# Altium project 260115710xxxx-HW-2.0.PrjPcb
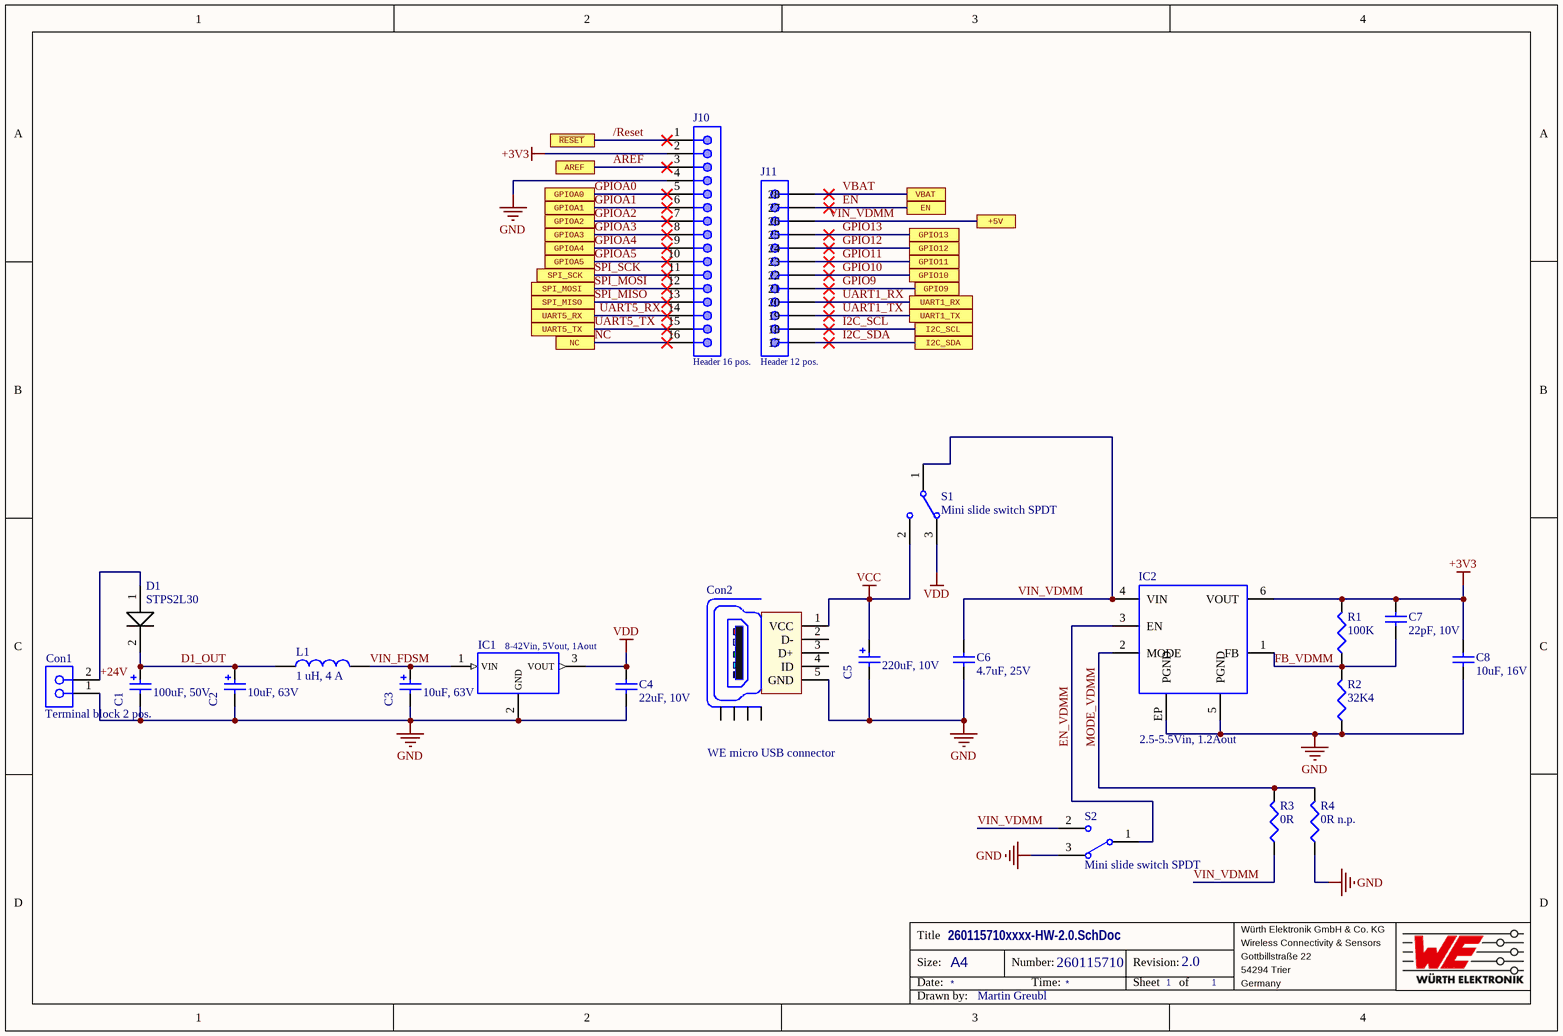
[diagram p0: 260115710xxxx-HW-2.0.SchDoc]
1 sheet, 22 parts. Net scope: flat (ports and power ports of the same name join across sheets).
Board file: 260115710xxxx-HW-2.0.PcbDoc

## Sheet 260115710xxxx-HW-2.0.SchDoc: FeatherWing
size A4; DrawnBy: Martin Greubl; DocumentNumber: 260115710; Revision: 2.0; SheetNumber: 1; SheetTotal: 1

### Parts
C1  100uF, 50V  [WCAP-ATG8_8x11.5]
C2  10uF, 63V  [WCAP-PSHP_8x8.7mm]
C3  10uF, 63V  [WCAP-PSHP_8x8.7mm]
C4  22uF, 10V  [WCAP-CSGP_0805_H=1.25mm]
C5  220uF, 10V  [WCAP-PSLP_6.3x5.8]
C6  4.7uF, 25V  [WCAP-CSGP_0805_H=1.25mm]
C7  22pF, 10V  [WCAP-CSGP_0805_H=0.6mm_Reflow]
C8  10uF, 16V  [WCAP-CSGP_0805_H=1.25mm]
Con1  Terminal block 2 pos.  [691805010302]
Con2  WE micro USB connector  [629105136821]
D1  Diode 30V/1A  [SMA Flat]  (value not drawn)
IC1  8-42Vin, 5Vout, 1Aout  [173010x35]
IC2  2.5-5.5Vin, 1.2Aout  [171010550]
J10  Header 16 pos.  [61301611121]
J11  Header 12 pos.  [61301211121]
L1  1 uH, 4 A  [WE-PD2_4532]
R1  100K  [SMD Resistor 0603 IPC]
R2  32K4  [SMD Resistor 0603 IPC]
R3  0R  [SMD Resistor 0402 IPC]
R4  0R n.p.  [SMD Resistor 0402 IPC]  (no BOM)
S1  Mini slide switch SPDT  [450301014042]
S2  Mini slide switch SPDT  [450301014042]

### Ports
+5V, AREF, EN, GPIO9, GPIO10, GPIO11, GPIO12, GPIO13, GPIOA0, GPIOA1, GPIOA2, GPIOA3, GPIOA4, GPIOA5, I2C_SCL, I2C_SDA, NC, SPI_MISO, SPI_MOSI, SPI_SCK, UART1_RX, UART1_TX, UART5_RX, UART5_TX, VBAT, ~{RESET}

### Nets
+3V3: C7.2 C8.1 IC2.6(VOUT) J10.2 R1.2
GND: C1.1(N) C2.1(N) C3.1(N) C4.2 C5.1(N) C6.2 C8.2 Con1.1 Con2.5(GND) IC1.2(GND) IC2.5(PGND) IC2.EP(PGND) J10.4 R2.1 R4.1 S2.3
VCC: C5.2(P) Con2.1(VCC) S1.2
VDD: C4.1 IC1.3(VOUT) S1.3
+24V: Con1.2 D1.1
/Reset: J10.1 ; port ~{RESET}
AREF: J10.3 ; port AREF
D1_OUT: C1.2(P) C2.2(P) D1.2 L1.1
EN: J11.11(27) ; port EN
EN_VDMM: IC2.3(EN) S2.1(COM)
FB_VDMM: C7.1 IC2.1(FB) R1.1 R2.2
GPIO9: J11.5(21) ; port GPIO9
GPIO10: J11.6(22) ; port GPIO10
GPIO11: J11.7(23) ; port GPIO11
GPIO12: J11.8(24) ; port GPIO12
GPIO13: J11.9(25) ; port GPIO13
GPIOA0: J10.5 ; port GPIOA0
GPIOA1: J10.6 ; port GPIOA1
GPIOA2: J10.7 ; port GPIOA2
GPIOA3: J10.8 ; port GPIOA3
GPIOA4: J10.9 ; port GPIOA4
GPIOA5: J10.10 ; port GPIOA5
I2C_SCL: J11.2(18) ; port I2C_SCL
I2C_SDA: J11.1(17) ; port I2C_SDA
MODE_VDMM: IC2.2(MODE) R3.2 R4.2
NC: J10.16 ; port NC
SPI_MISO: J10.13 ; port SPI_MISO
SPI_MOSI: J10.12 ; port SPI_MOSI
SPI_SCK: J10.11 ; port SPI_SCK
UART1_RX: J11.4(20) ; port UART1_RX
UART1_TX: J11.3(19) ; port UART1_TX
UART5_RX: J10.14 ; port UART5_RX
UART5_TX: J10.15 ; port UART5_TX
VBAT: J11.12(28) ; port VBAT
VIN_FDSM: C3.2(P) IC1.1(VIN) L1.2
VIN_VDMM: C6.1 IC2.4(VIN) J11.10(26) R3.1 S1.1(COM) S2.2 ; port +5V

Not connected (* = marked no-connect by the designer): Con2 2(D-) 3(D+) 4(ID) Z1(Shield) Z2(Shield) Z3(Shield) Z4(Shield)

### Notes on the sheet
- Title
- Size:
- Date:
- A4
- Number:
- Time:
- Revision:
- Sheet
- of
- Würth Elektronik GmbH & Co. KG
- Wireless Connectivity & Sensors
- Gottbillstraße 22
- 54294 Trier
- Germany
- Drawn by:

### Library data of the parts
C1 = 860010674014: WCAP-ATG8 THT Aluminum Electrolytic Capacitors, D8mm x L11.5mm, 100uF, +/-20%, 50VDC; Manufacturer: Würth Elektronik eiSos; Dissipation Factor: 10%; Endurance: 2000h; Leakage Current: 50uA; Ripple Current max.: 286mA; Technical Reference: ATBE115101M050DSPA7B000; ComponentLink1Description: Manufacturer; ComponentLink1URL: http://www.we-online.de; ComponentLink2Description: Datasheet; ComponentLink2URL: https://katalog.we-online.com/pbs/datasheet/860010674014.pdf; Length: 11.5mm; Mounting Technology: THT; Operating Temperature: -40 to +85degC; Packaging: Ammo Pack; Published Date: August 2019; Capacitance: 100uF; Diameter: 8mm; Part Number: 860010674014; Publisher: Wurth Elektronik; Capacitance Tolerance: +/-20%; Rated Voltage: 50VDC
C2 C3 = 875115852001: WCAP-PSHP Aluminum Polymer Capacitors, size 8x8.7mm, 10uF, +/-20%, 63VDC; Manufacturer: Würth Elektronik eiSos; Dissipation Factor: 12%; ESR: 45mOhm; Leakage Current: 126uA; Ripple Current: 1.5A; Technical Reference: PSEE087100M063DVCTEB000; ComponentLink1Description: Manufacturer; ComponentLink1URL: http://www.we-online.de; ComponentLink2Description: Datasheet; ComponentLink2URL: https://katalog.we-online.com/pbs/datasheet/875115852001.pdf; Mounting Technology: SMD; Operating Temperature: -55 to +105degC; Packaging: Tape and Reel; Part Number: 875115852001; Publisher: Wurth Elektronik; Capacitance: 10uF; Height: 8.7mm; Diameter: 8mm; Published Date: August 2019; Rated Voltage: 63VDC; Size: 8x8.7mm; Capacitance Tolerance: +/-20%
C4 = 885012107011: WCAP-CSGP General Purpose Ceramic Capacitors, size 0805, 22uF, +/-20%, 10VDC; Manufacturer: Würth Elektronik eiSos; Isolation Resistance: >=0.005GOhm; Ceramic Type: X5R; Technical Reference: X5R0805226M010DFCT10000; ComponentLink1Description: Manufacturer; ComponentLink1URL: http://www.we-online.de; ComponentLink2Description: Datasheet; ComponentLink2URL: https://katalog.we-online.com/pbs/datasheet/885012107011.pdf; Operating Temperature: -55 to +85degC; Packaging: Tape and Reel; Part Number: 885012107011; Publisher: Wurth Elektronik; Rated Voltage: 10VDC; Published Date: August 2019; Capacitance Tolerance: +/-20%; Dissipation Factor: =<10%; Height: 1.25mm +0.20/-0.00mm; Mounting Technology: SMT; Size: 0805; Capacitance: 22uF
C5 = 875105244013: WCAP-PSLP Aluminum Polymer Capacitors, D6.3mm, L5.8mm, 220uF, +/-20%, 10VDC; Manufacturer: Würth Elektronik eiSos; Dissipation Factor: 8%; ESR: 30mOhm; Endurance: 2000h; Leakage Current: 300uA; Ripple Current max.: 1970mA; Technical Reference: PSED058221M010DVCTBB000; ComponentLink1Description: Manufacturer; ComponentLink1URL: http://www.we-online.de; ComponentLink2Description: Datasheet; ComponentLink2URL: https://katalog.we-online.com/pbs/datasheet/875105244013.pdf; Length: 5.8mm; Mounting Technology: SMD; Operating Temperature: -55 to +105degC; Packaging: Tape and Reel; Published Date: August 2019; Capacitance: 220uF; Diameter: 6.3mm; Part Number: 875105244013; Publisher: Wurth Elektronik; Capacitance Tolerance: +/-20%; Rated Voltage: 10VDC
C6 = 885012107018: WCAP-CSGP General Purpose Ceramic Capacitors, size 0805, 4.7uF, +/-20%, 25VDC; Manufacturer: Würth Elektronik eiSos; Isolation Resistance: >=0.02GOhm; Ceramic Type: X5R; Technical Reference: X5R0805475M025DFCT10000; ComponentLink1Description: Manufacturer; ComponentLink1URL: http://www.we-online.de; ComponentLink2Description: Datasheet; ComponentLink2URL: https://katalog.we-online.com/pbs/datasheet/885012107018.pdf; Operating Temperature: -55 to +85degC; Packaging: Tape and Reel; Part Number: 885012107018; Publisher: Wurth Elektronik; Rated Voltage: 25VDC; Published Date: August 2019; Capacitance Tolerance: +/-20%; Dissipation Factor: =<10%; Height: 1.25mm +/-0.20mm; Mounting Technology: SMT; Size: 0805; Capacitance: 4.7uF
C7 = 885012007002: WCAP-CSGP General Purpose Ceramic Capacitors, size 0805, 22pF, +/-5%, 10VDC; Manufacturer: Würth Elektronik eiSos; Isolation Resistance: >=10GOhm; Ceramic Type: NP0; Dissipation Factor: Q>=400+20C; Technical Reference: NP00805220J010DFCT10000; ComponentLink1Description: Manufacturer; ComponentLink1URL: http://www.we-online.de; ComponentLink2Description: Datasheet; ComponentLink2URL: https://katalog.we-online.com/pbs/datasheet/885012007002.pdf; Operating Temperature: -55 to +125degC; Packaging: Tape and Reel; Part Number: 885012007002; Publisher: Wurth Elektronik; Rated Voltage: 10VDC; Published Date: August 2019; Capacitance Tolerance: +/-5%; Height: 0.6mm +/-0.10mm; Mounting Technology: SMT; Size: 0805; Capacitance: 22pF
C8 = 885012107014: WCAP-CSGP General Purpose Ceramic Capacitors, size 0805, 10uF, +/-20%, 16VDC; Manufacturer: Würth Elektronik eiSos; Isolation Resistance: >=0.005GOhm; Ceramic Type: X5R; Technical Reference: X5R0805106M016DFCT10000; ComponentLink1Description: Manufacturer; ComponentLink1URL: http://www.we-online.de; ComponentLink2Description: Datasheet; ComponentLink2URL: https://katalog.we-online.com/pbs/datasheet/885012107014.pdf; Operating Temperature: -55 to +85degC; Packaging: Tape and Reel; Part Number: 885012107014; Publisher: Wurth Elektronik; Rated Voltage: 16VDC; Published Date: August 2019; Capacitance Tolerance: +/-20%; Dissipation Factor: =<10%; Height: 1.25mm +/-0.20mm; Mounting Technology: SMT; Size: 0805; Capacitance: 10uF
Con1 = 691805010302: WR-TBL Serie 8050 Horizontal Entry SMT, Screwless, pitch 2.5mm, 2p; Manufacturer: Würth Elektronik eiSos; Compliance: Lead free / RoHS; Modularity: No; PCB/Cable/Panel: PCB; Pin Number: 2; Rated Current [UL]: 6A; Working Voltage [UL]: 300VAC; ComponentLink1Description: Manufacturer; ComponentLink1URL: http://www.we-online.de; ComponentLink2URL: https://katalog.we-online.de/em/datasheet/691805010302.pdf; ComponentLink2Description: Datasheet; Mounting Technology: SMT; Part Number: 691805010302; Packaging: Tape and Reel; Operating Temperature: -45 to +130degC; Pitch: 2.5mm; Published Date: October 2019; Type: Horizontal; Publisher: Wurth Elektronik; Application: Screwless
Con2 = WE-Communication Connectors 629105136821: WR-COM Micro USB SMT Type B; Manufacturer: Würth Elektronik eiSos; ComponentLink1 Description: Manufacturer; ComponentLink2 Description: Datasheet; NoPins: 5; ComponentLink1URL: http://www.we-online.de; ComponentLink2URL: http://katalog.we-online.de/em/datasheet/629105136821.pdf; Created by: Karrer Zheng; Created Date: 10/10/2014; Part Number: 629105136821
D1 = STPS2L30: Single chip Schottky rectifiers STPS2L30, size SMA Flat, If 1 A, Vrrm 30 V, Vf 0.325 V; Manufacturer: STMicroelectronics; Forward current: 1 A; Forward voltage drop: 0.325 V; Repetitive peak reverse voltage: 30 V; Maximum operating junction temperature: +150 degC; Reverse leakage current: 200 uA; Mounting Technology: SMT; Storage temperature range: -65 to +150 degC; Part Number: STPS2L30; Packaging: Tape and ree; Publisher: STMicroelectronics
IC1 = 173010535: MagI3C-FDSM Fixed Step Down Regulator Module, SIP-3, 8-36Vin, 5Vout, 1Aout; Part Number: 173010542; Manufacturer: Würth Elektronik eiSos; Output Current: 1A; Output Voltage: 5V; Input Voltage: 8-42V; ComponentLink1Description: Manufacturer; ComponentLink1URL: http://www.we-online.de; ComponentLink2Description: Datasheet; ComponentLink2URL: https://www.we-online.com/catalog/datasheet/173010542.pdf; Packaging: Tube; Published Date: March 2020; Mounting Technology: THT; Height: 10.5mm; Length: 11.6mm; Operating Temperature: -40 to +85degC; Publisher: Wurth Elektronik; Size: SIP-3; Width: 8.5mm
IC2 = 171010550: MagI3C-VDMM Variable Step Down MicroModule, LGA-6EP, 2.5-5.5Vin, 1.2Aout; Manufacturer: Würth Elektronik eiSos; Output Current: 1.2A; Output Voltage: 0.8-5.5V; ComponentLink1Description: Manufacturer; ComponentLink1URL: http://www.we-online.de; ComponentLink2Description: Datasheet; ComponentLink2URL: https://katalog.we-online.de/pm/datasheet/171010550.pdf; Mounting Technology: SMT; Height: 1.2mm; Input Voltage: 2.5-5.5V; Operating Temperature: -40 to +125degC; Length: 2.5mm; Part Number: 171010550; Packaging: Tape and Reel; Published Date: October 2019; Width: 2.5mm; Publisher: Wurth Elektronik; Size: LGA-6EP
J10 = 61301611121: THT Vertical Pin Header WR-PHD, Pitch 2.54 mm, Single Row, 16 pins; Part Number: SSQ-116-03-T-S; Manufacturer: Samtec; Pin Number: 16; Pitch: 2.54 mm; Gender: Male / Female; Rated Current: 3 A; Withstanding Voltage: 465 VAC; Contact Resistance: 20 mOhm; ComponentLink1Description: Manufacturer; ComponentLink1URL: http://www.we-online.de; ComponentLink2Description: Datasheet; ComponentLink2URL: https://katalog.we-online.de/em/datasheet/6130xx11121.pdf; Published Date: May 2020; Publisher: Samtec; Operating Temperature: -40 to 105 degC; Mounting Technology: THT; Packaging: Bag; Working Voltage: N/A; Row Number: Single; Orientation: Vertical
J11 = 61301211121: THT Vertical Pin Header WR-PHD, Pitch 2.54 mm, Single Row, 12 pins; Part Number: SSQ-116-03-T-S; Manufacturer: Samtec; Pin Number: 12; Pitch: 2.54 mm; Gender: Male; Rated Current: 3 A; Withstanding Voltage: 465 VAC; Contact Resistance: 20 mOhm; ComponentLink1Description: Manufacturer; ComponentLink1URL: http://www.we-online.de; ComponentLink2Description: Datasheet; ComponentLink2URL: https://katalog.we-online.de/em/datasheet/6130xx11121.pdf; Published Date: August 2018; Publisher: Samtec; Operating Temperature: -40 to 105 degC; Mounting Technology: THT; Packaging: Bag; Working Voltage: N/A; Row Number: Single; Orientation: Vertical
L1 = 7447730: SMT Power Inductor WE-PD2, size 4532, 1 uH, 4 A; Manufacturer: Würth Elektronik eiSos; Rated Current: 4 A; Inductance: 1 uH; DC Resistance max.: 0.049 Ohm; Self Resonant Frequency: 110 MHz; Saturation Current: 5.72 A; ComponentLink1Description: Manufacturer; ComponentLink1URL: http://www.we-online.de; ComponentLink2Description: Datasheet; ComponentLink2URL: https://katalog.we-online.com/pbs/datasheet/7447730.pdf; Part Number: 7447730; Published Date: December 2018; Publisher: Wurth Elektronik; Size: 4532; Operating Temperature: -40 to +125 degC; Mounting Technology: SMT; Packaging: Tape and Reel
R1 = SMD_Resistor: SMD Resistor /100k / 0603/ 1%; Manufacturer: Yageo; Part Number: AC0603FR-10100KL; Latest Revision Note: Created; Power Rating: 100mW; Published: 2020; Latest Revision Date: 2018.10.31; Publisher: Würth Elektronik; Package Description: Chip Resistor; Mounting Style: SMD; TK: *; Tolerance: 1%; Size: 0603; Provided by WE: *; Value: 100K
R2 = SMD_Resistor: SMD Resistor / 32k4 / 0603 / 1%; Manufacturer: Yageo; Part Number: RC0603FR-0732K4L; Latest Revision Note: Created; Power Rating: 100mW; Published: 2018.10.31; Latest Revision Date: 2018.10.31; Publisher: Würth Elektronik; Package Description: Chip Resistor; Mounting Style: SMD; TK: *; Tolerance: 1%; Size: 0603; Provided by WE: *; Value: 32K4
R3 R4 = SMD_Resistor: SMD Resistor / 0R / 0402 / 1%; Manufacturer: Yageo; Part Number: RC0402FR-070RL; Latest Revision Note: Created; Power Rating: 62.5mW; Published: 2020; Latest Revision Date: 2018.10.31; Publisher: Würth Elektronik; Package Description: Chip Resistor; Mounting Style: SMD; TK: *; Tolerance: N/A; Size: 0402; Provided by WE: *
  R3: Value: 0R
  R4: Value: 0R n.p.
S1 S2 = 450301014042: WS-SLTV THT Mini Slide Switch, Opposite Side Connection, SPDT; Manufacturer: Würth Elektronik eiSos; Rated Current: 500mA; Rated Voltage: 12VDC; Switching Function: On-On; ComponentLink1Description: Manufacturer; ComponentLink1URL: http://www.we-online.de; ComponentLink2Description: Datasheet; ComponentLink2URL: https://katalog.we-online.com/em/datasheet/450301014042.pdf; Packaging: Bulk; Publisher: Wurth Elektronik; Contact Material: Copper Alloy; Mounting Technology: THT; Operating Temperature: -40 to +85degC; Contact Plating: Gold; Part Number: 450301014042; Published Date: September 2019; Terminal Material: Copper Alloy; Size: 10x2.5mm; Circuit: SPDT; Terminal Plating: Gold